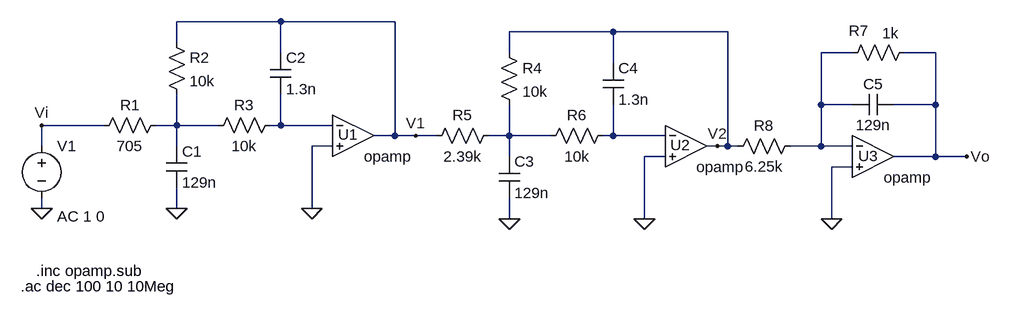
[diagram p0: schematic Ej_3b.asc]
Ej_3b.asc, the LTspice schematic file:
Version 4
SHEET 1 1168 680
WIRE 64 -64 -96 -64
WIRE 240 -64 64 -64
WIRE 576 -48 416 -48
WIRE 752 -48 576 -48
WIRE -96 -32 -96 -64
WIRE 64 -16 64 -64
WIRE 416 -16 416 -48
WIRE 944 -16 896 -16
WIRE 1072 -16 1024 -16
WIRE 576 0 576 -48
WIRE 896 64 896 -16
WIRE 944 64 896 64
WIRE 1072 64 1072 -16
WIRE 1072 64 1008 64
WIRE -208 96 -304 96
WIRE -96 96 -96 48
WIRE -96 96 -128 96
WIRE -32 96 -96 96
WIRE 64 96 64 48
WIRE 64 96 48 96
WIRE 144 96 64 96
WIRE 240 112 240 -64
WIRE 240 112 208 112
WIRE 272 112 240 112
WIRE 304 112 272 112
WIRE 416 112 416 64
WIRE 416 112 384 112
WIRE 480 112 416 112
WIRE 576 112 576 64
WIRE 576 112 560 112
WIRE 656 112 576 112
WIRE -304 128 -304 96
WIRE -96 128 -96 96
WIRE 144 128 112 128
WIRE 736 128 720 128
WIRE 752 128 752 -48
WIRE 752 128 736 128
WIRE 768 128 752 128
WIRE 896 128 896 64
WIRE 896 128 848 128
WIRE 944 128 896 128
WIRE 416 144 416 112
WIRE 656 144 624 144
WIRE 1072 144 1072 64
WIRE 1072 144 1008 144
WIRE 1120 144 1072 144
WIRE 944 160 912 160
WIRE -304 224 -304 208
WIRE -96 224 -96 192
WIRE 112 224 112 128
WIRE 416 240 416 208
WIRE 624 240 624 144
WIRE 912 240 912 160
FLAG -96 224 0
FLAG 112 224 0
FLAG 416 240 0
FLAG 624 240 0
FLAG 912 240 0
FLAG 1120 144 Vo
FLAG -304 96 Vi
FLAG -304 224 0
FLAG 272 112 V1
FLAG 736 128 V2
SYMBOL OpAmps\\opamp 176 48 R0
WINDOW 0 -24 62 Left 2
SYMATTR InstName U1
SYMBOL cap -112 128 R0
SYMATTR InstName C1
SYMATTR Value 129n
SYMBOL cap 48 -16 R0
SYMATTR InstName C2
SYMATTR Value 1.3n
SYMBOL res -112 -48 R0
SYMATTR InstName R2
SYMATTR Value 10k
SYMBOL res -112 80 R90
WINDOW 0 0 56 VBottom 2
WINDOW 3 32 56 VTop 2
SYMATTR InstName R1
SYMATTR Value 705
SYMBOL res 64 80 R90
WINDOW 0 0 56 VBottom 2
WINDOW 3 32 56 VTop 2
SYMATTR InstName R3
SYMATTR Value 10k
SYMBOL OpAmps\\opamp 688 64 R0
WINDOW 0 -24 62 Left 2
SYMATTR InstName U2
SYMBOL cap 400 144 R0
SYMATTR InstName C3
SYMATTR Value 129n
SYMBOL cap 560 0 R0
SYMATTR InstName C4
SYMATTR Value 1.3n
SYMBOL res 400 -32 R0
SYMATTR InstName R4
SYMATTR Value 10k
SYMBOL res 400 96 R90
WINDOW 0 0 56 VBottom 2
WINDOW 3 32 56 VTop 2
SYMATTR InstName R5
SYMATTR Value 2.39k
SYMBOL res 576 96 R90
WINDOW 0 0 56 VBottom 2
WINDOW 3 32 56 VTop 2
SYMATTR InstName R6
SYMATTR Value 10k
SYMBOL OpAmps\\opamp 976 80 R0
WINDOW 0 -23 63 Left 2
SYMATTR InstName U3
SYMBOL cap 1008 48 R90
WINDOW 0 0 32 VBottom 2
WINDOW 3 32 32 VTop 2
SYMATTR InstName C5
SYMATTR Value 129n
SYMBOL res 1040 -32 R90
WINDOW 0 -2 86 VBottom 2
WINDOW 3 -30 37 VTop 2
SYMATTR InstName R7
SYMATTR Value 1k
SYMBOL res 864 112 R90
WINDOW 0 0 56 VBottom 2
WINDOW 3 32 56 VTop 2
SYMATTR InstName R8
SYMATTR Value 6.25k
SYMBOL voltage -304 112 R0
WINDOW 123 24 124 Left 2
WINDOW 39 0 0 Left 0
SYMATTR Value2 AC 1 0
SYMATTR InstName V1
SYMATTR Value ""
TEXT -312 320 Left 2 !.inc opamp.sub
TEXT -336 344 Left 2 !.ac dec 100 10 10Meg

The netlist it stands for:
* Ej_3b.asc
XU1 N003 0 V1 opamp Aol=100K GBW=10Meg  ; pins invin noninvin out
C1 N002 0 129n
C2 V1 N003 1.3n
R2 V1 N002 10k
R1 N002 Vi 705
R3 N003 N002 10k
XU2 N005 0 V2 opamp Aol=100K GBW=10Meg  ; pins invin noninvin out
C3 N004 0 129n
C4 V2 N005 1.3n
R4 V2 N004 10k
R5 N004 V1 2.39k
R6 N005 N004 10k
XU3 N001 0 Vo opamp Aol=100K GBW=10Meg  ; pins invin noninvin out
C5 Vo N001 129n
R7 Vo N001 1k
R8 N001 V2 6.25k
V1 Vi 0 AC 1 0
.inc opamp.sub
.ac dec 100 10 10Meg
.backanno
.end